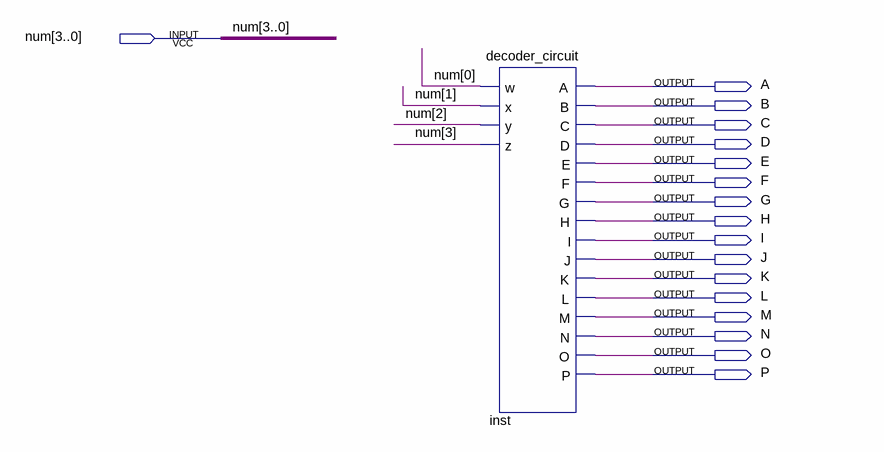
[diagram p0: schematic sheet]
// Quartus schematic decoder.bdf as structural Verilog: 1 symbols, 17 pins
module decoder (
  input  [3:0] num,
  output A,
  output B,
  output C,
  output D,
  output E,
  output F,
  output G,
  output H,
  output I,
  output J,
  output K,
  output L,
  output M,
  output N,
  output O,
  output P
);

  decoder_circuit inst (
    .w(num[0]), .x(num[1]), .y(num[2]), .z(num[3]), .A(A), .B(B), .C(C), .D(D), .E(E), .F(F), .G(G), .H(H),
    .I(I), .J(J), .K(K), .L(L), .M(M), .N(N), .O(O), .P(P));
endmodule
